# EAGLE design miniprot (EAGLE 8.7.0)

## Sheet 1 of 2
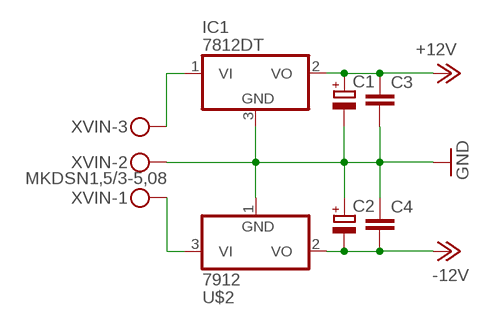
[diagram p0: schematic, sheet 1]

### Parts
C1  CPOL-EUE2.5-7  [E2,5-7]
C2  CPOL-EUE2.5-7  [E2,5-7]
C3  C-EUC0805  [C0805]
C4  C-EUC0805  [C0805]
IC1  7812DT  [TO252]
U$2  7912  [TO252]
XVIN  MKDSN1,5/3-5,08  [MKDSN1,5/3-5,08]

### Nets
+12V: C1.+ C3.1 IC1.2(VO) ; also sheet 2
-12V: C2.- C4.2 U$2.2(VO) ; also sheet 2
GND: C1.- C2.+ C3.2 C4.1 IC1.3(GND) U$2.1(GND) XVIN.2 ; also sheet 2
N$1: IC1.1(VI) XVIN.3
N$3: U$2.3(VI) XVIN.1

## Sheet 2 of 2
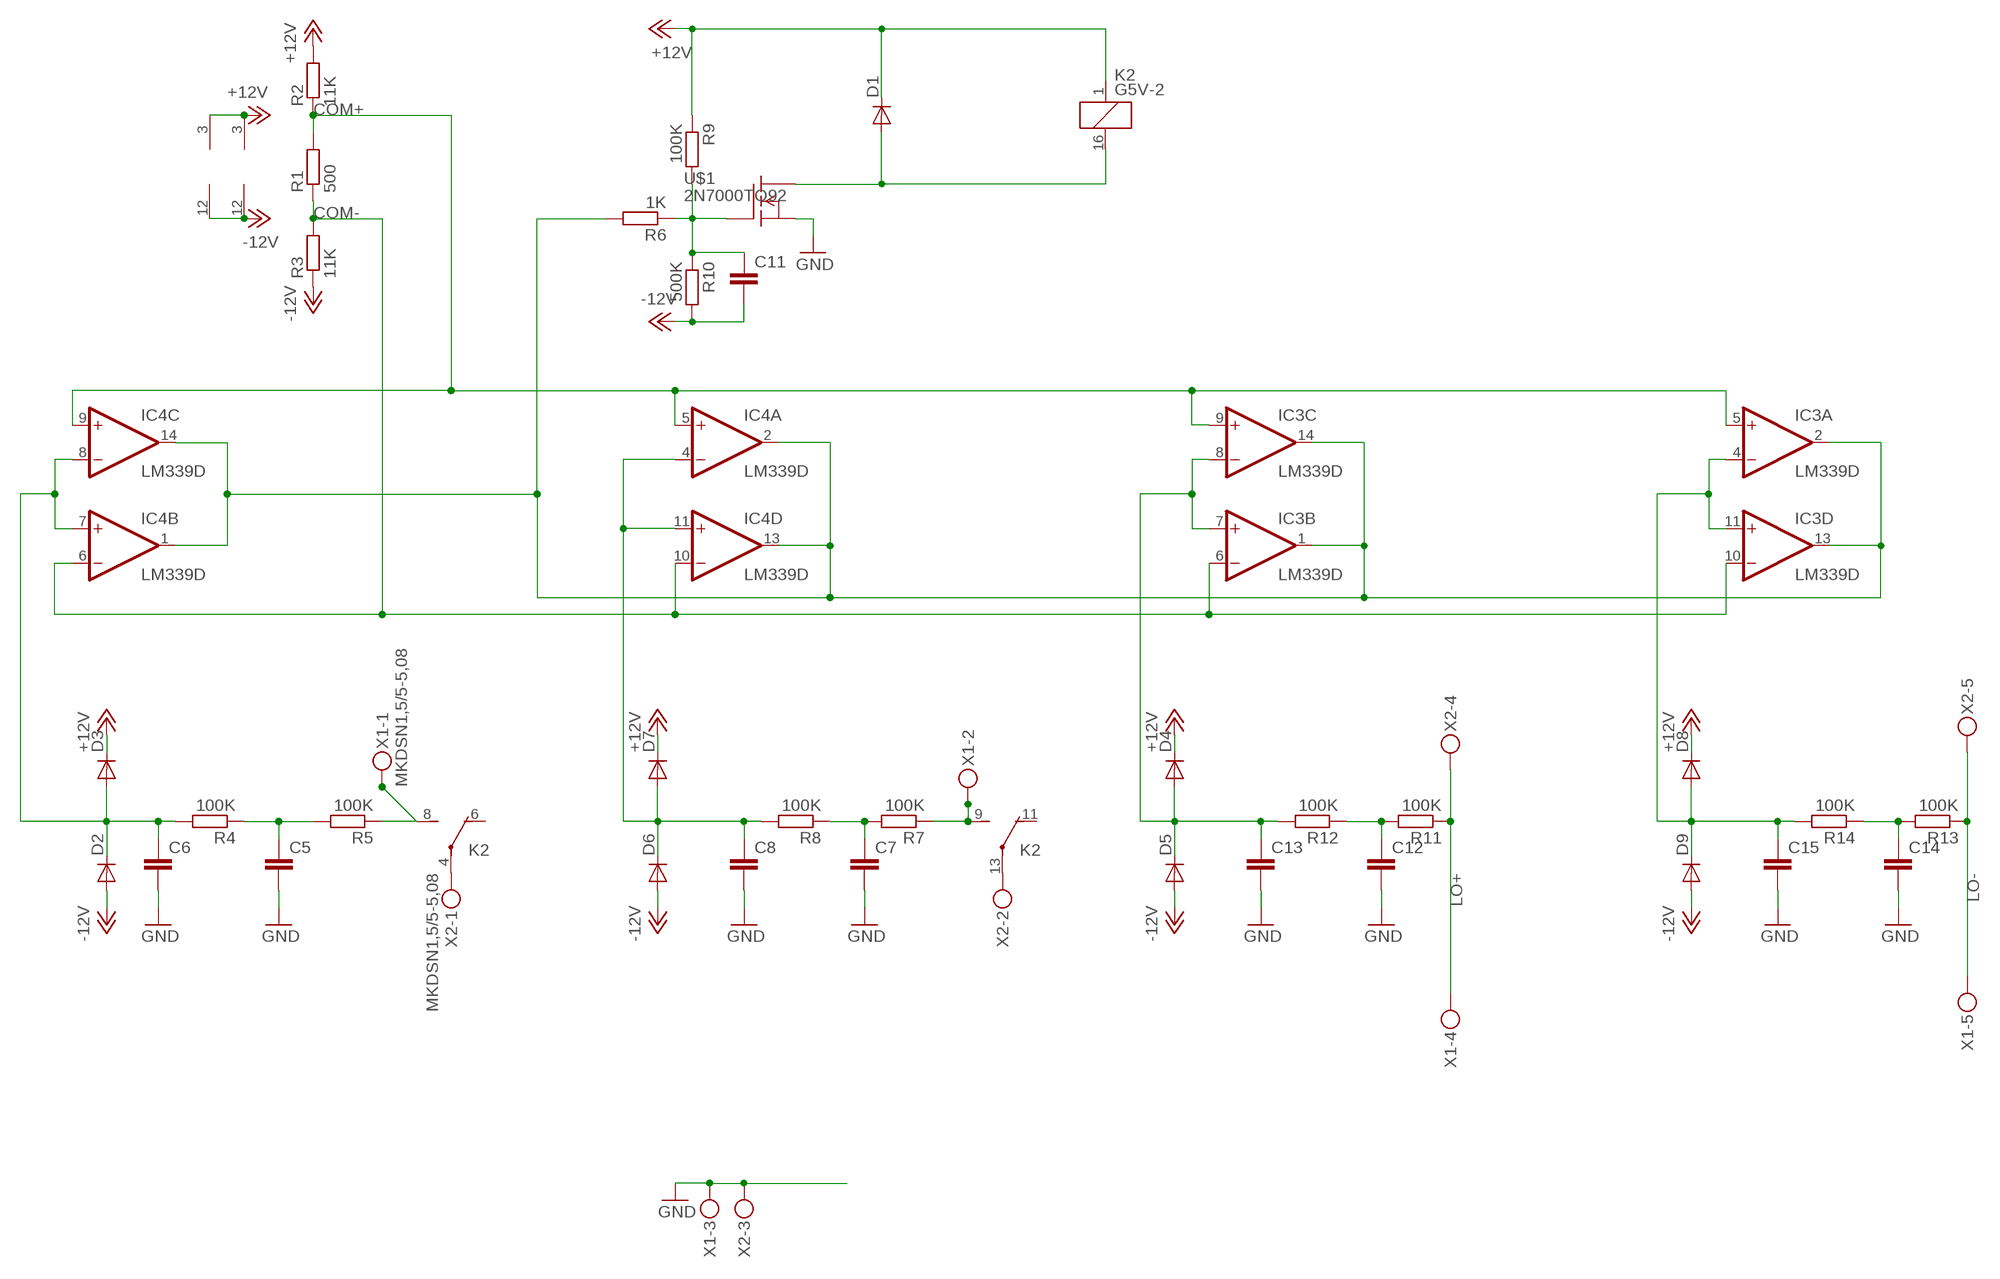
[diagram p1: schematic, sheet 2]

### Parts
C5  C-EUC0805  [C0805]
C6  C-EUC0805  [C0805]
C7  C-EUC0805  [C0805]
C8  C-EUC0805  [C0805]
C11  C-EUC1210  [C1210]
C12  C-EUC0805  [C0805]
C13  C-EUC0805  [C0805]
C14  C-EUC0805  [C0805]
C15  C-EUC0805  [C0805]
D1  DIODE-DO214AC  [DO214AC]
D2  DIODE-SOD80C  [SOD80C]
D3  DIODE-SOD80C  [SOD80C]
D4  DIODE-SOD80C  [SOD80C]
D5  DIODE-SOD80C  [SOD80C]
D6  DIODE-SOD80C  [SOD80C]
D7  DIODE-SOD80C  [SOD80C]
D8  DIODE-SOD80C  [SOD80C]
D9  DIODE-SOD80C  [SOD80C]
IC3  LM339D  [SO14]
IC4  LM339D  [SO14]
K2  G5V-2  [G5V-2]
R1  500  R-EU_R0805  [R0805]
R2  11K  R-EU_R0805  [R0805]
R3  11K  R-EU_R0805  [R0805]
R4  100K  R-EU_R0805  [R0805]
R5  100K  R-EU_R0805  [R0805]
R6  1K  R-EU_R0805  [R0805]
R7  100K  R-EU_R0805  [R0805]
R8  100K  R-EU_R0805  [R0805]
R9  100K  R-EU_R0805  [R0805]
R10  500K  R-EU_R0805  [R0805]
R11  100K  R-EU_R0805  [R0805]
R12  100K  R-EU_R0805  [R0805]
R13  100K  R-EU_R0805  [R0805]
R14  100K  R-EU_R0805  [R0805]
U$1  2N7000TO92  [TO92-]
X1  MKDSN1,5/5-5,08  [MKDSN1,5/5-5,08]
X2  MKDSN1,5/5-5,08  [MKDSN1,5/5-5,08]

### Nets
+12V: D1.C D3.C D4.C D7.C D8.C IC3.3(P:V+) IC4.3(P:V+) K2.1 R2.2 R9.1 ; also sheet 1
-12V: C11.2 D2.A D5.A D6.A D9.A IC3.12(P:GND) IC4.12(P:GND) R3.1 R10.2 ; also sheet 1
COM+: IC3.5(A:+IN) IC3.9(C:+IN) IC4.5(A:+IN) IC4.9(C:+IN) R1.2 R2.1
COM-: IC3.6(B:-IN) IC3.10(D:-IN) IC4.6(B:-IN) IC4.10(D:-IN) R1.1 R3.2
GND: C5.2 C6.2 C7.2 C8.2 C12.2 C13.2 C14.2 C15.2 U$1.3(S) X1.3 X2.3 ; also sheet 1
LO+: R11.1 X1.4 X2.4
LO-: R13.1 X1.5 X2.5
N$2: IC3.1(B:OUT) IC3.2(A:OUT) IC3.13(D:OUT) IC3.14(C:OUT) IC4.1(B:OUT) IC4.2(A:OUT) IC4.13(D:OUT) IC4.14(C:OUT) R6.2
N$4: K2.8(1:S) R5.1 X1.1
N$5: C7.1 R7.2 R8.1
N$6: C5.1 R4.1 R5.2
N$7: K2.9(2:S) R7.1 X1.2
N$10: K2.13(2:P) X2.2
N$11: C11.1 R6.1 R9.2 R10.1 U$1.2(G)
N$12: C6.1 D2.C D3.A IC4.7(B:+IN) IC4.8(C:-IN) R4.2
N$13: C8.1 D6.C D7.A IC4.4(A:-IN) IC4.11(D:+IN) R8.2
N$14: D1.A K2.16 U$1.1(D)
N$15: C13.1 D4.A D5.C IC3.7(B:+IN) IC3.8(C:-IN) R12.2
N$16: C15.1 D8.A D9.C IC3.4(A:-IN) IC3.11(D:+IN) R14.2
N$17: K2.4(1:P) X2.1
N$19: C12.1 R11.2 R12.1
N$21: C14.1 R13.2 R14.1
Unconnected: K2.6(1:O) K2.11(2:O)

## Library data of the parts
C1 C2 = Vwvwbg:CPOL-EU: POLARIZED CAPACITOR, European symbol
C3-C8 C11-C15 = Vwvwbg:C-EU: CAPACITOR, European symbol
D1-D9 = diode:DIODE-: DIODE
IC1 = adafruit:78*: Positive VOLTAGE REGULATOR Added bigger pads to the TO-92 package
IC3 IC4 = linear:LM339: Low Power Low Offset Voltage Quad Comparators with open collector; LM139/LM239/LM339/LM2901/LM3302
K2 = relay:G5V-2: OMRON PCB Relay Source: http://www.omron.com/ecb/products/pdf/en-g5v2.pdf; MPN: G5V-2 5DC; OC_FARNELL: 9949488; OC_NEWARK: 78K5703
R1-R14 = Vwvwbg:R-EU_: RESISTOR, European symbol
U$1 = tranzistory FET:2N7000
U$2 = adafruit:7912
X1 X2 = con-phoenix-508:MKDSN1,5/5-5,08: MKDSN 1,5/ 5-5,08 Printklemme Nennstrom: 13,5 A Nennspannung: 250 V Rastermaß: 5,08 mm Polzahl: 5 Anschlussart: Schraubanschluss Montage: Löten Anschlussrichtung Leiter/Platine: 0 ° Artikelnummer: 1729157 Source: http://eshop.phoenixcontact.com .. 1729157.pdf
XVIN = con-phoenix-508:MKDSN1,5/3-5,08: MKDSN 1,5/ 3-5,08 Printklemme Nennstrom: 13,5 A Nennspannung: 250 V Rastermaß: 5,08 mm Polzahl: 3 Anschlussart: Schraubanschluss Montage: Löten Anschlussrichtung Leiter/Platine: 0 ° Artikelnummer: 1729131 Source: http://eshop.phoenixcontact.com .. 1729131.pdf

## Board
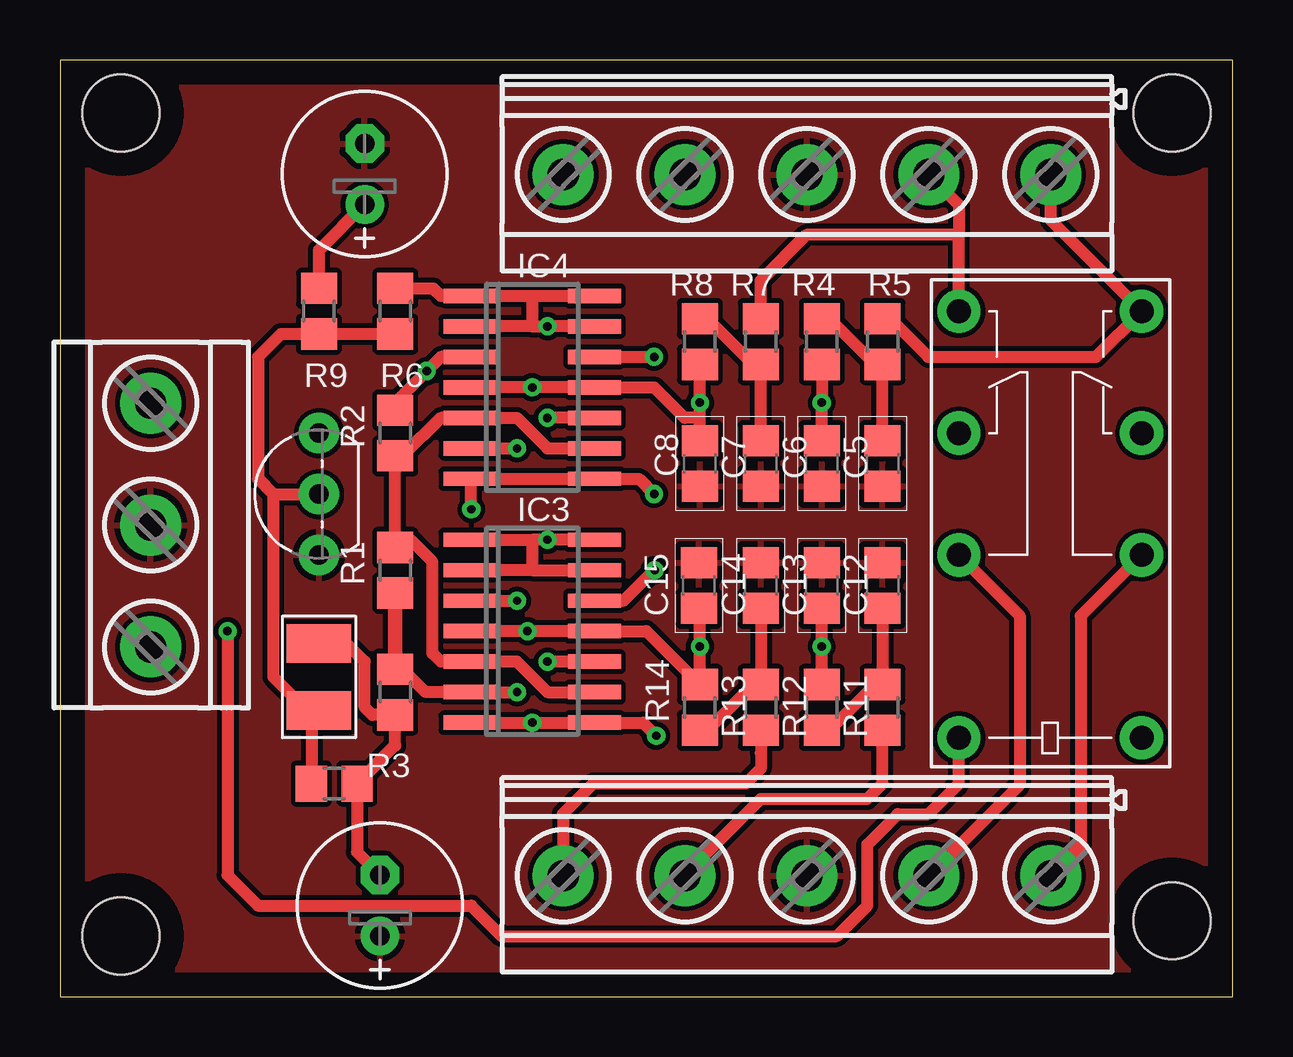
[diagram p2: board, top side]
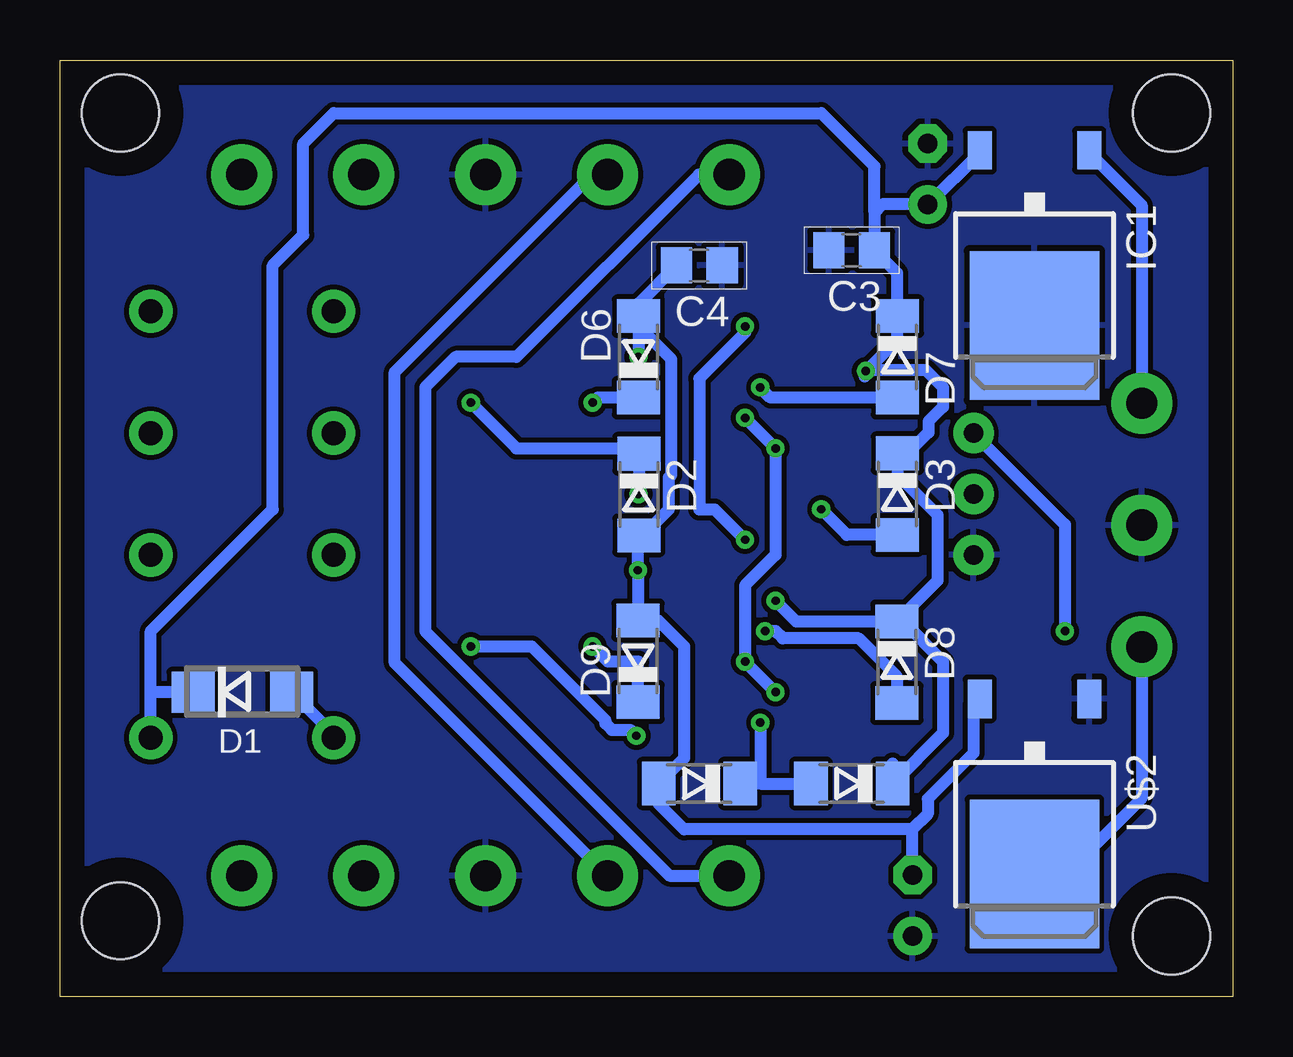
[diagram p3: board, bottom side, seen from below]

Size 48.88 x 39.04 mm. Coordinates in mm from the lower left corner, seen from the top.
Outline: 0,0 48.88,0 48.88,39.04 0,39.04 0,0
Copper layers (1*16): Top 0.035mm / dielectric 1.5mm / Bottom 0.035mm
Design rules "default": minimum track width 10mil, minimum drill 24mil, track to track 8mil, track to pad 8mil, pad to pad 8mil, via to via 8mil, smd to smd 8mil, copper to edge 40mil, drill to drill 8mil, minimum pad ring 10mil, minimum via ring 8mil, stop-mask expansion 4mil, vias tented up to drill 0mil, thermal gap 10mil
Holes 3.2 mm at 2.54,36.83 2.54,2.54 46.36,3.17 46.36,36.83

### Footprints (pad centres in the part's own frame; a part is rotated, then mirrored left to right if it is on the bottom)
E2,5-7 = drill 0.813 pad 1.6: + -1.27,0 | drill 0.813 pad 1.6 octagon: - 1.27,0
C0805 = smd 1.3 x 1.5: 1 -0.95,0; 2 0.95,0
C1210 = smd 1.6 x 2.7: 1 -1.4,0; 2 1.4,0
DO214AC = smd 1.8 x 1.7: A 2.05,0; C -2.05,0
SOD80C = smd 1.4 x 1.8: A 1.7,0; C -1.7,0
TO252 = smd 1 x 1.6: 1 -2.28,-4.8; 2 2.28,-4.8 | smd 5.4 x 6.2: 3 0,2.5
SO14 = smd 0.6 x 2.2: 1 -3.81,-2.6; 2 -2.54,-2.6; 3 -1.27,-2.6; 4 0,-2.6; 5 1.27,-2.6; 6 2.54,-2.6; 7 3.81,-2.6; 8 3.81,2.6; 9 2.54,2.6; 10 1.27,2.6; 11 0,2.6; 12 -1.27,2.6; 13 -2.54,2.6; 14 -3.81,2.6
G5V-2 = drill 1 pad 1.8: 1 -8.89,-3.81; 4 -1.27,-3.81; 6 3.81,-3.81; 8 8.89,-3.81; 9 8.89,3.81; 11 3.81,3.81; 13 -1.27,3.81; 16 -8.89,3.81
R0805 = smd 1.3 x 1.5: 1 -0.95,0; 2 0.95,0
TO92- = drill 0.813 pad 1.676: 1 2.54,0; 2 0,0; 3 -2.54,0
MKDSN1,5/5-5,08 = drill 1.3 pad 2.54: 1 -10.181,0.025; 2 -5.101,0.025; 3 -0.021,0.025; 4 5.059,0.025; 5 10.139,0.025
MKDSN1,5/3-5,08 = drill 1.3 pad 2.54: 1 -7.641,0.025; 2 -2.561,0.025; 3 2.519,0.025

### Placement (x,y rotation side)
C1  12.7,34.29 90 top
C2  13.34,3.81 90 top
C3  15.88,31.11 180 bottom
C4  22.23,30.48 180 bottom
C5  34.29,22.22 270 top
C6  31.75,22.22 270 top
C7  29.21,22.22 270 top
C8  26.67,22.22 270 top
C11  10.8,13.33 90 top
C12  34.29,17.14 90 top
C13  31.75,17.14 90 top
C14  29.21,17.14 90 top
C15  26.63,17.14 90 top
D1  41.27,12.7 0 bottom
D2  24.74,20.93 270 bottom
D3  13.97,20.95 270 bottom
D4  15.88,8.89 180 bottom
D5  22.23,8.89 180 bottom
D6  24.77,26.67 90 bottom
D7  13.97,26.67 270 bottom
D8  13.99,13.95 270 bottom
D9  24.79,13.99 90 bottom
IC1  8.25,30.48 180 bottom
IC3  19.69,15.24 270 top
IC4  19.69,25.4 270 top
K2  41.27,19.68 90 top
R1  13.97,17.78 90 top
R2  13.97,23.49 90 top
R3  13.97,12.7 90 top
R4  31.75,27.3 270 top
R5  34.29,27.3 270 top
R6  13.97,28.57 90 top
R7  29.21,27.3 270 top
R8  26.67,27.3 270 top
R9  10.8,28.57 270 top
R10  11.43,8.89 0 top
R11  34.29,12.06 90 top
R12  31.75,12.06 90 top
R13  29.21,12.06 90 top
R14  26.67,12.06 90 top
U$1  10.8,20.95 90 top
U$2  8.25,7.62 180 bottom
X1  31.12,34.29 180 top
X2  31.12,5.08 180 top
XVIN  3.81,22.22 90 top

### Tracks (layer width: path | path; a pad name or v marks a point on that pad's centre or on a via)
+12V  (via drill 0.35)
  Top 0.508: IC4.3 15.88,26.67 v15.28,26.08 13.97,24.76 R2.2 | IC3.3 v19.05,16.51 | C1.+ 10.8,31.11 R9.1
  Bottom 0.508: D8.C 18.19,15.65 v19.05,16.51 | 14.93,32.7 C3.1 13.97,30.16 D7.C 13.97,27.39 v15.28,26.08 | v15.28,26.08 15.28,25.9 15.33,25.86 | v15.28,26.08 15.11,26.08 15.06,26.13 12.79,26.13 12.07,25.4 12.07,24.59 12.68,23.98 12.68,23.52 13.34,22.86 13.77,22.86 D3.C 13.97,21.77 12.29,20.09 12.29,17.35 D8.C | 14.18,9.73 D4.C 12.07,11 12.07,13.97 13.75,15.65 D8.C | K2.1 45.09,12.7 | 45.09,12.7 45.09,15.24 40.01,20.32 40.01,30.48 38.73,31.75 38.73,35.56 37.47,36.83 17.14,36.83 14.93,34.61 14.93,32.7 | D1.C 45.09,12.7 | IC1.2 10.54,35.19 C1.+ 14.61,33.02 14.93,32.7
-12V  (via drill 0.35)
  Top 0.508: IC4.12 v24.77,26.67 | 10.84,14.73 C11.2 11.94,14.73 12.7,13.97 12.7,12.06 13.02,11.75 R3.1 13.97,10.48 R10.2 12.38,6.03 C2.- | IC3.12 23.5,16.51 24.77,17.78 v24.79,17.78
  Bottom 0.508: 24.77,27.94 v24.77,26.67 | 24.77,27.94 D6.A 24.77,28.89 C4.2 | 24.77,27.94 23.39,26.56 23.39,21.74 23.5,21.64 23.5,20.32 24.58,19.23 D2.A 24.79,19.19 v24.79,17.78 D9.A 23.95,15.69 22.86,14.61 22.86,9.95 D5.A | D5.A 24.13,9.52 | U$2.2 10.8,12.16 10.8,10.16 12.7,8.25 12.7,7.62 13.34,6.99 | D5.A 23.93,8.05 22.86,6.99 13.34,6.99 | C2.- 13.34,6.99
COM+
  Top 0.508: IC4.9 20.32,22.86 19.05,24.13 IC4.5 15.88,24.13 14.29,22.54 R2.1 R1.2 14.29,19.05 14.61,19.05 15.53,18.13 15.53,14.32 15.88,13.97 IC3.5 19.05,13.97 20.32,12.7 IC3.9
COM-  (via drill 0.35)
  Top 0.508: IC4.6 v19.05,22.86 | IC4.10 v20.32,24.13 | v19.05,12.7 IC3.6 15.24,12.7 14.29,13.65 R3.2 | IC3.10 v20.32,13.97
  Top 0.61: R1.1 R3.2
  Bottom 0.508: v20.32,24.13 v19.05,22.86 19.05,18.41 20.32,17.14 v20.32,13.97 v19.05,12.7
GND
  pour Top: 50.14,41.91 -3.2,41.91 -3.2,-3.81 50.14,-3.81
  pour Bottom: -3.18,40.64 55.24,40.64 55.24,-5.08 -3.18,-5.08
LO+
  Top 0.508: X2.4 26.06,5.1 29.21,8.25 33.66,8.25 34.29,8.89 R11.1
  Bottom 0.508: X2.4 34.92,13.92 34.92,26.04 26.7,34.27 X1.4
LO-
  Top 0.508: 29.21,10.16 R13.1 29.21,9.52 28.58,8.89 22.23,8.89 20.96,7.62 20.98,7.6 X2.5
  Bottom 0.508: X1.5 22.25,34.27 29.84,26.67 32.38,26.67 33.66,25.4 33.66,15.24 23.47,5.06 X2.5
N$1
  Bottom 0.508: IC1.1 5.98,35.19 3.78,33 XVIN.3
N$2  (via drill 0.35)
  Top 0.508: 19.69,29.21 IC4.1 15.88,29.21 15.56,29.53 R6.2 | 19.69,29.21 IC4.14 | 19.69,27.94 IC4.2 | 19.69,27.94 v20.32,27.94 IC4.13 | 19.69,29.21 19.69,27.94 | IC3.1 19.69,19.05 | IC3.14 v20.32,19.05 19.69,19.05 | 19.69,17.78 IC3.2 | 19.69,17.78 IC3.13 | 19.69,19.05 19.69,17.78
  Bottom 0.508: v20.32,27.94 20.32,27.68 22.23,25.77 22.23,20.32 21.59,20.32 v20.32,19.05
N$3
  Bottom 0.508: XVIN.1 3.78,8.28 6.94,5.12 U$2.3
N$4
  Top 0.508: R5.1 34.61,28.25 36.2,26.67 43.18,26.67 K2.8 41.3,32.36 X1.1
N$5
  Top 0.508: C7.1 R7.2 28.89,26.36 27.3,27.94 26.98,27.94 R8.1
N$6
  Top 0.508: C5.1 R5.2 33.97,26.36 32.38,27.94 32.06,27.94 R4.1
N$7
  Top 0.508: R7.1 29.21,29.85 31.12,31.75 37.47,31.75 | X1.2 37.47,33.02 37.47,31.75 | K2.9 37.47,31.75
N$10
  Top 0.508: K2.13 40.01,15.88 40.01,8.84 X2.2
N$11
  Top 0.508: 8.89,20.95 8.25,21.59 8.25,26.67 9.21,27.62 R9.2 R6.1 | 8.89,20.95 8.89,13.33 10.8,11.43 C11.1 10.48,11.62 R10.1 | 8.89,20.95 U$1.2
N$12  (via drill 0.35)
  Top 0.508: R4.2 v31.75,24.76 C6.1 | v24.77,20.95 24.13,21.59 IC4.8 IC4.7 17.14,21.53 v17.14,20.32
  Bottom 0.508: v31.75,24.76 29.84,22.86 24.97,22.86 D2.C | D2.C 24.75,20.97 v24.77,20.95 | D2.C 24.54,22.63 | D3.A 16.08,19.25 v17.14,20.32
N$13  (via drill 0.35)
  Top 0.508: C8.1 26.67,24.13 | R8.2 v26.67,24.76 26.67,24.13 | 26.67,24.13 26.04,24.13 24.77,25.4 IC4.11 v19.69,25.4 IC4.4
  Bottom 0.508: D6.C 26.47,24.97 v26.67,24.76 | D7.A 19.25,24.97 v19.69,25.4
N$14  (via drill 0.35)
  Top 0.508: v6.99,15.24 6.99,5.08 8.25,3.81 17.14,3.81 18.41,2.54 32.38,2.54 33.66,3.81 33.66,6.35 34.92,7.62 36.2,7.62 37.47,8.89 K2.16
  Bottom 0.508: U$1.1 6.99,19.68 v6.99,15.24 | D1.A 37.47,10.94 K2.16
N$15  (via drill 0.35)
  Top 0.508: C13.1 v31.75,14.61 R12.2 | v24.85,10.88 24.3,11.43 IC3.8 v19.69,11.43 IC3.7
  Bottom 0.508: v31.75,14.61 29.21,14.61 26.14,11.54 26.14,11.4 25.88,11.13 25.1,11.13 v24.85,10.88 | 19.69,8.89 D4.A | 19.69,8.89 D5.C | v19.69,11.43 19.69,8.89
N$16  (via drill 0.35)
  Top 0.508: IC3.4 v19.48,15.24 IC3.11 24.45,15.24 R14.2 v26.67,14.61 26.67,16.15 C15.1
  Bottom 0.508: D9.C 24.79,13.95 24.77,13.97 26.04,13.97 v26.67,14.61 | D8.A 13.99,13.36 15.57,14.94 18.75,14.94 19.05,15.24 v19.48,15.24
N$17
  Top 0.508: K2.4 42.55,15.88 42.55,6.3 X2.1
N$19
  Top 0.508: C12.1 R11.2 33.97,13.02 32.38,11.43 32.06,11.43 R12.1
N$21
  Top 0.508: 28.89,13.02 R13.2 | 28.89,13.02 27.3,11.43 26.98,11.43 R14.1 | C14.1 29.21,13.33 28.89,13.02